# Altium schematic sheet Inputs.SchDoc: Inputs
size Letter; Date: 2019-07-18; DocumentNumber: 2; Revision: B; SheetNumber: 2; SheetTotal: 7; ProjectTitle: SDRdrum Arty Shield; PageSetup: Record=PageOptions|CenterHorizontal=True|CenterVertical=True|PrintScale=0.98|XCorrection=1.00|YCorrection=1.00|PrintKind=2|BorderSize=5000000|LeftOffset=0|BottomOffset=0|Orientation=2|PaperLength=1000|PaperWidth=1000|Scale=100|PaperSource=7|PrintQuality=-3|MediaType=1|DitherType=10|PrintScaleMode=1|PaperKind=Tabloid|PaperIndex=3
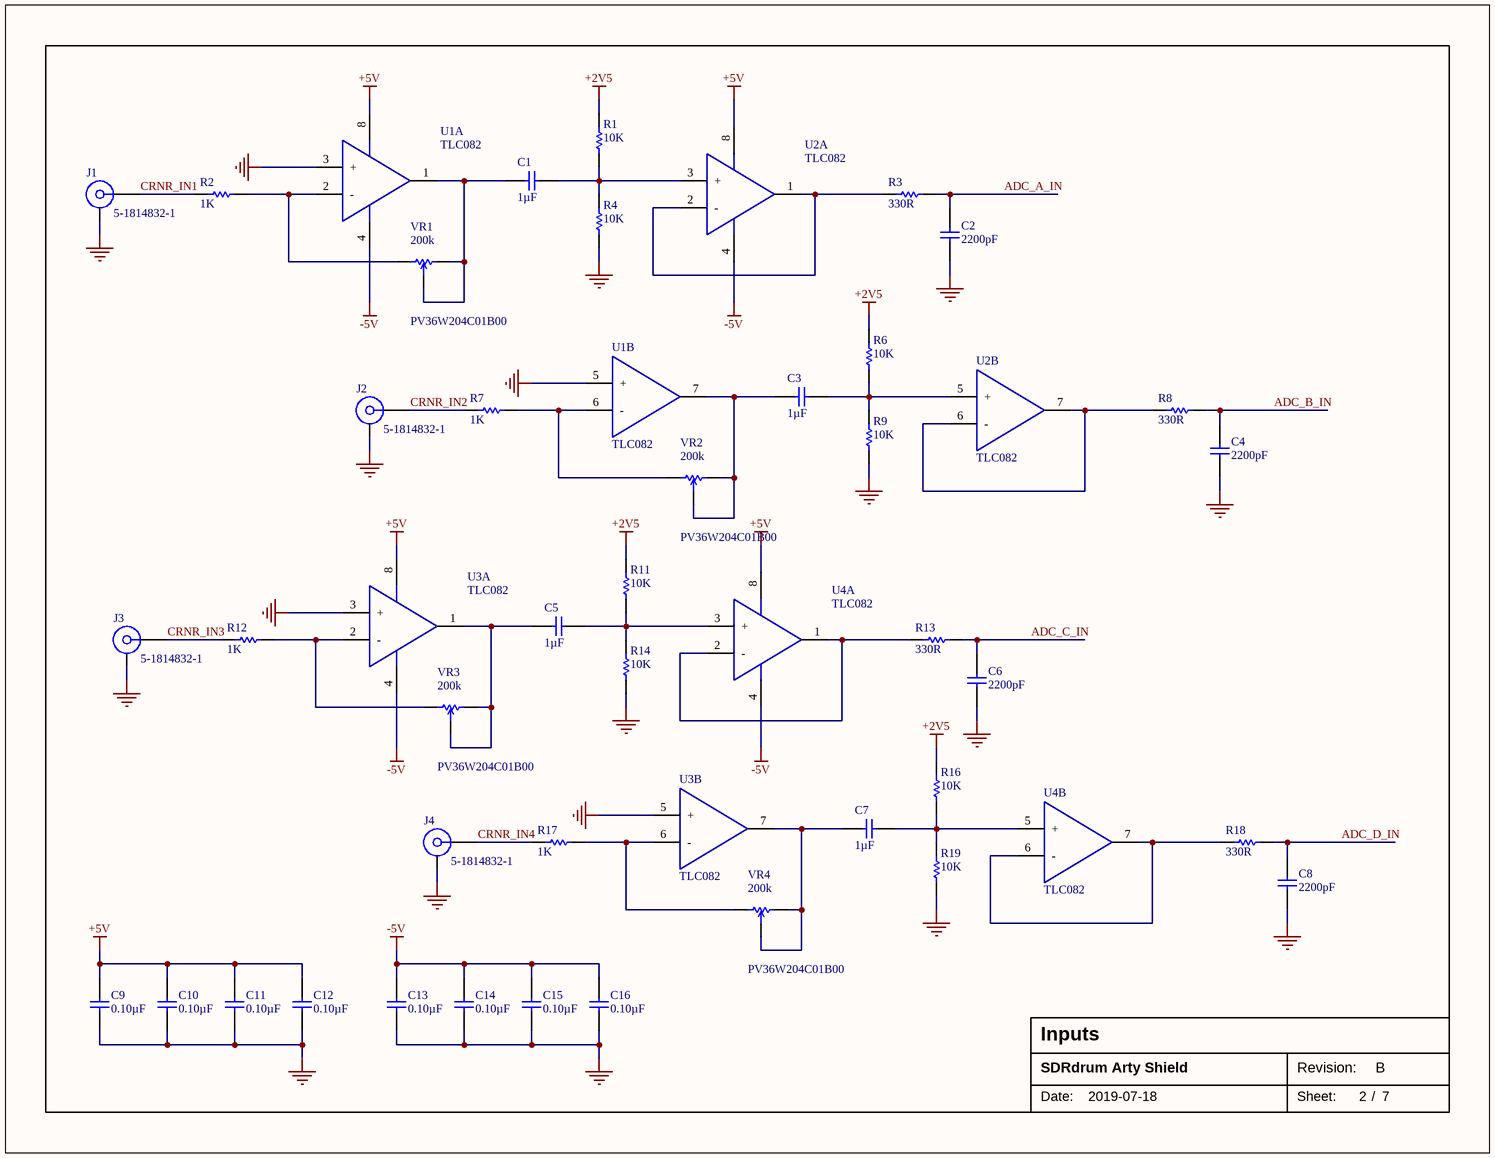
[diagram p0: Inputs.SchDoc]

## Parts
C1  value 1µF  [CAP-0402-M]  (hidden comment: Capacitor)
C2  value 2200pF  [CAP-0402-M]  (hidden comment: CAP 2200pF ±10% 25V 0402 X7R)
C3  value 1µF  [CAP-0402-M]  (hidden comment: Capacitor)
C4  value 2200pF  [CAP-0402-M]  (hidden comment: CAP 2200pF ±10% 25V 0402 X7R)
C5  value 1µF  [CAP-0402-M]  (hidden comment: Capacitor)
C6  value 2200pF  [CAP-0402-M]  (hidden comment: CAP 2200pF ±10% 25V 0402 X7R)
C7  value 1µF  [CAP-0402-M]  (hidden comment: Capacitor)
C8  value 2200pF  [CAP-0402-M]  (hidden comment: CAP 2200pF ±10% 25V 0402 X7R)
C9  value 0.10µF  [CAP-0402-M]  (hidden comment: Capacitor)
C10  value 0.10µF  [CAP-0402-M]  (hidden comment: Capacitor)
C11  value 0.10µF  [CAP-0402-M]  (hidden comment: Capacitor)
C12  value 0.10µF  [CAP-0402-M]  (hidden comment: Capacitor)
C13  value 0.10µF  [CAP-0402-M]  (hidden comment: Capacitor)
C14  value 0.10µF  [CAP-0402-M]  (hidden comment: Capacitor)
C15  value 0.10µF  [CAP-0402-M]  (hidden comment: Capacitor)
C16  value 0.10µF  [CAP-0402-M]  (hidden comment: Capacitor)
J1  5-1814832-1  [5-1814832-1]
J2  5-1814832-1  [5-1814832-1]
J3  5-1814832-1  [5-1814832-1]
J4  5-1814832-1  [5-1814832-1]
R1  value 10K  [RES-0603-M]  (hidden comment: RES 10K 1% 1/10 W 0603 ±100ppm/°C)
R2  value 1K  [RES-0603-M]  (hidden comment: Resistor)
R3  value 330R  [RES-0603-M]  (hidden comment: RES 330R 1% 1/10 W 0603 ±100ppm/°C)
R4  value 10K  [RES-0603-M]  (hidden comment: RES 10K 1% 1/10 W 0603 ±100ppm/°C)
R6  value 10K  [RES-0603-M]  (hidden comment: RES 10K 1% 1/10 W 0603 ±100ppm/°C)
R7  value 1K  [RES-0603-M]  (hidden comment: Resistor)
R8  value 330R  [RES-0603-M]  (hidden comment: RES 330R 1% 1/10 W 0603 ±100ppm/°C)
R9  value 10K  [RES-0603-M]  (hidden comment: RES 10K 1% 1/10 W 0603 ±100ppm/°C)
R11  value 10K  [RES-0603-M]  (hidden comment: RES 10K 1% 1/10 W 0603 ±100ppm/°C)
R12  value 1K  [RES-0603-M]  (hidden comment: Resistor)
R13  value 330R  [RES-0603-M]  (hidden comment: RES 330R 1% 1/10 W 0603 ±100ppm/°C)
R14  value 10K  [RES-0603-M]  (hidden comment: RES 10K 1% 1/10 W 0603 ±100ppm/°C)
R16  value 10K  [RES-0603-M]  (hidden comment: RES 10K 1% 1/10 W 0603 ±100ppm/°C)
R17  value 1K  [RES-0603-M]  (hidden comment: Resistor)
R18  value 330R  [RES-0603-M]  (hidden comment: RES 330R 1% 1/10 W 0603 ±100ppm/°C)
R19  value 10K  [RES-0603-M]  (hidden comment: RES 10K 1% 1/10 W 0603 ±100ppm/°C)
U1  TLC082  [SOIC127P600X175-8M]  (parts A,B of 4)
U2  TLC082  [SOIC127P600X175-8M]  (parts A,B of 4)
U3  TLC082  [SOIC127P600X175-8M]  (parts A,B of 4)
U4  TLC082  [SOIC127P600X175-8M]  (parts A,B of 4)
VR1  PV36W204C01B00  value 200k  [PV36W]
VR2  PV36W204C01B00  value 200k  [PV36W]
VR3  PV36W204C01B00  value 200k  [PV36W]
VR4  PV36W204C01B00  value 200k  [PV36W]

## Nets
+2V5: R1.2 R6.2 R11.2 R16.2
+5V: C9.1 C10.1 C11.1 C12.1 U1.8(NC) U2.8(NC) U3.8(NC) U4.8(NC)
-5V: C13.1 C14.1 C15.1 C16.1 U1.4(V-) U2.4(V-) U3.4(V-) U4.4(V-)
GND: C2.1 C4.1 C6.1 C8.1 C9.2 C10.2 C11.2 C12.2 C13.2 C14.2 C15.2 C16.2 J1.MH J2.MH J3.MH J4.MH R4.1 R9.1 R14.1 R19.1 U1.3(+) U1.5(+) U3.3(+) U3.5(+)
ADC_A_IN: C2.2 R3.2
ADC_B_IN: C4.2 R8.2
ADC_C_IN: C6.2 R13.2
ADC_D_IN: C8.2 R18.2
CRNR_IN1: J1.1 R2.2
CRNR_IN2: J2.1 R7.2
CRNR_IN3: J3.1 R12.2
CRNR_IN4: J4.1 R17.2
NetC1_1: C1.1 U1.1(NC) VR1.2 VR1.3
NetC1_2: C1.2 R1.1 R4.2 U2.3(+)
NetC3_1: C3.1 U1.7(OUT1) VR2.2 VR2.3
NetC3_2: C3.2 R6.1 R9.2 U2.5(+)
NetC5_1: C5.1 U3.1(NC) VR3.2 VR3.3
NetC5_2: C5.2 R11.1 R14.2 U4.3(+)
NetC7_1: C7.1 U3.7(OUT1) VR4.2 VR4.3
NetC7_2: C7.2 R16.1 R19.2 U4.5(+)
NetR2_1: R2.1 U1.2(-) VR1.1
NetR3_1: R3.1 U2.1(NC) U2.2(-)
NetR7_1: R7.1 U1.6(-) VR2.1
NetR8_1: R8.1 U2.6(-) U2.7(OUT1)
NetR12_1: R12.1 U3.2(-) VR3.1
NetR13_1: R13.1 U4.1(NC) U4.2(-)
NetR17_1: R17.1 U3.6(-) VR4.1
NetR18_1: R18.1 U4.6(-) U4.7(OUT1)

## Notes on the sheet
- Date:
- Revision:
- Sheet:
- /

## Library data of the parts
C1 C3 C5 C7 = CC0402KRX5R6BB105: Manufacturer: Yageo; Manufacturer Series: CC; Tolerance: ±10%; Voltage: 10V; Temperature Coefficient: X5R; Part Number: CC0402KRX5R6BB105; Component Type: Standard; Package: 0402; Temperature Range: -55°C ~ 85°C; Supplier 1: Digi-Key; Supplier Part Number 1: 311-1439-1-ND
C2 C4 C6 C8 = CC0402KRX7R8BB222: Manufacturer: Yageo; Manufacturer Series: CC; Part Number: CC0402KRX7R8BB222; Component Type: Standard; Tolerance: ±10%; Voltage: 25V; Package: 0402; Temperature Coefficient: X7R; Temperature Range: -55°C ~ 125°C; Supplier 1: Digi-Key; Supplier Part Number 1: 311-1714-1-ND
C9-C16 = CC0402KRX5R6BB104: Manufacturer: Yageo; Manufacturer Series: CC; Tolerance: ±10%; Voltage: 10V; Temperature Coefficient: X5R; Part Number: CC0402KRX5R6BB104; Component Type: Standard; Package: 0402; Temperature Range: -55°C ~ 85°C; Supplier 1: Digi-Key; Supplier Part Number 1: 311-1336-1-ND
R1 R4 R6 R9 R11 R14 R16 R19 = RC0603FR-0710KL: Manufacturer: Yageo; Manufacturer Series: RC; Power: 1/10 W; Part Number: RC0603FR-0710KL; Component Type: Standard; Tolerance: 1%; Package: 0603; Temperature Coefficient: ±100ppm/°C; Temperature Range: -55°C ~ 155°C; Supplier 1: Digi-Key; Supplier Part Number 1: 311-10.0KHRCT-ND
R2 R7 R12 R17 = RC0603FR-071KL: Manufacturer: Yageo; Manufacturer Series: RC; Tolerance: 1%; Power: 1/10 W; Temperature Coefficient: ±100ppm/°C; Part Number: RC0603FR-071KL; Component Type: Standard; Package: 0603; Temperature Range: -55°C ~ 155°C; Supplier 1: Digi-Key; Supplier Part Number 1: 311-1.00KHRCT-ND
R3 R8 R13 R18 = RC0603FR-07330RL: Manufacturer: Yageo; Manufacturer Series: RC; Power: 1/10 W; Part Number: RC0603FR-07330RL; Component Type: Standard; Tolerance: 1%; Package: 0603; Temperature Coefficient: ±100ppm/°C; Temperature Range: -55°C ~ 155°C; Supplier 1: Digi-Key; Supplier Part Number 1: 311-330HRCT-ND
U1-U4 = TLC082: 36-V, PrOperational Amplifiers, 8-Pin SOIC
VR1-VR4 = PV36W204C01B00: Potentiometer, 200 k, 10%, 0.5 W, Through Hole; Supplier 1: Digi-Key; Supplier Part Number 1: 490-2882-ND